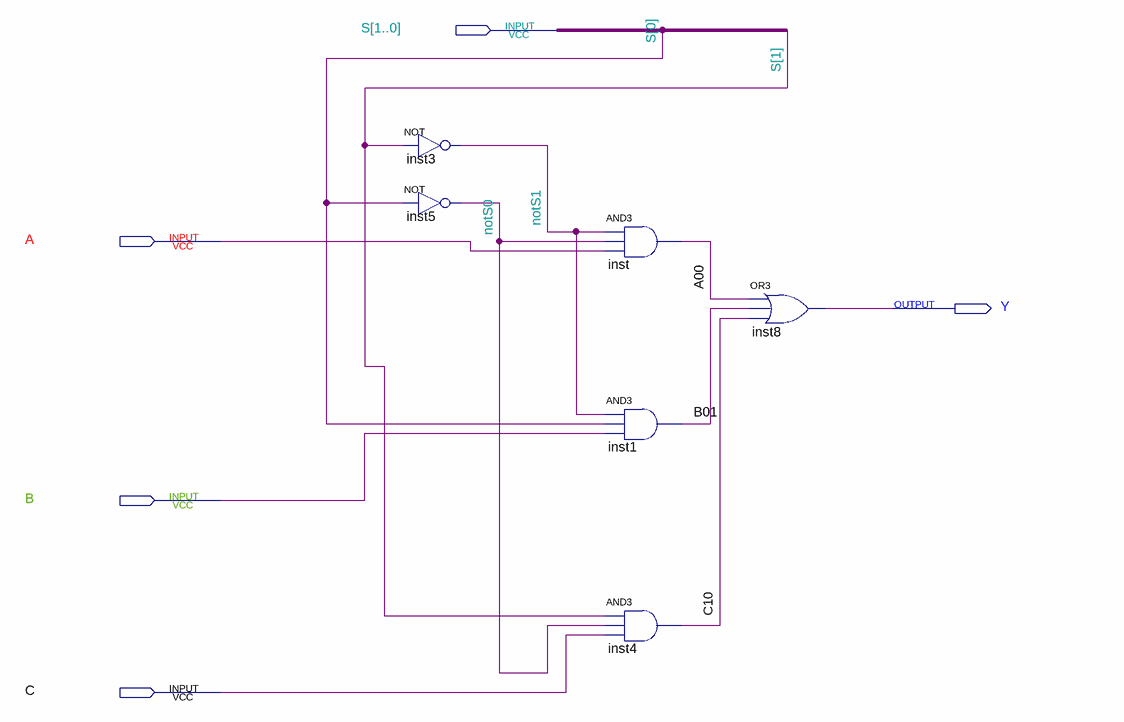
[diagram p0: schematic sheet]
// Quartus schematic MUX3.bdf as structural Verilog: 6 symbols, 5 pins
module MUX3 (
  input  [1:0] S,
  input  A,
  input  B,
  input  C,
  output Y
);

  wire A00, B01, C10, notS0, notS1;

  not inst3 (notS1, S[1]);
  not inst5 (notS0, S[0]);
  and inst (A00, notS1, notS0, A);
  and inst1 (B01, notS1, S[0], B);
  and inst4 (C10, S[1], notS0, C);
  or inst8 (Y, A00, B01, C10);
endmodule
